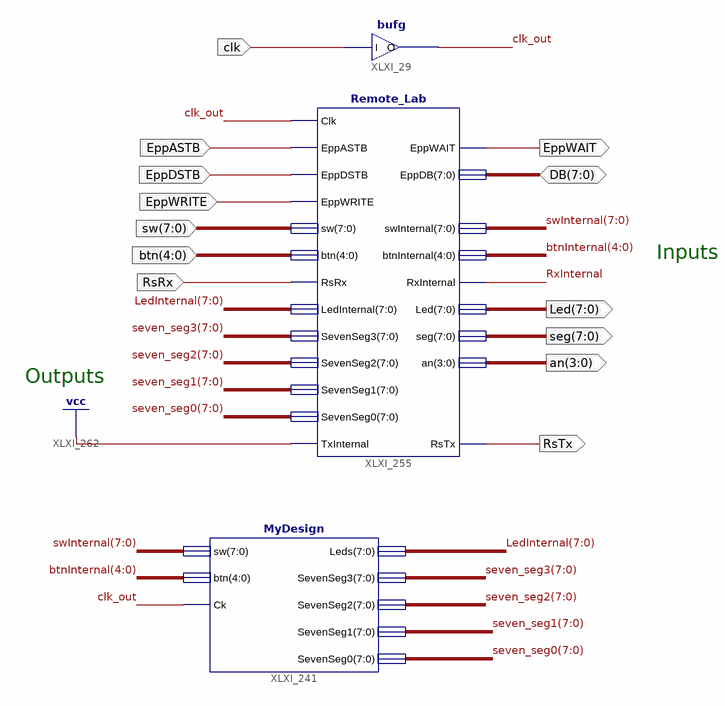
[diagram p0: schematic sheet 1]
// Xilinx ISE schematic top.sch (spartan6) as structural Verilog: 3 symbols, 13 ports
module top (
  input  EppASTB,
  input  EppDSTB,
  input  [7:0] sw,
  input  [4:0] btn,
  input  EppWRITE,
  input  RsRx,
  input  clk,
  inout  [7:0] DB,
  output EppWAIT,
  output [7:0] Led,
  output [7:0] seg,
  output [3:0] an,
  output RsTx
);

  wire clk_out, RxInternal;
  wire [4:0] btnInternal;
  wire [7:0] LedInternal, seven_seg0, seven_seg1, seven_seg2, seven_seg3, swInternal;

  MyDesign XLXI_241 (
    .btn(btnInternal), .Ck(clk_out), .Leds(LedInternal), .SevenSeg0(seven_seg0), .SevenSeg1(seven_seg1),
    .SevenSeg2(seven_seg2), .SevenSeg3(seven_seg3), .sw(swInternal));
  Remote_Lab XLXI_255 (
    .Clk(clk_out), .EppASTB(EppASTB), .EppDSTB(EppDSTB), .RsTx(RsTx), .EppWRITE(EppWRITE), .sw(sw),
    .btn(btn), .RsRx(RsRx), .LedInternal(LedInternal), .SevenSeg3(seven_seg3), .SevenSeg2(seven_seg2),
    .SevenSeg1(seven_seg1), .SevenSeg0(seven_seg0), .TxInternal(1'b1), .seg(seg), .an(an),
    .RxInternal(RxInternal), .swInternal(swInternal), .Led(Led), .EppWAIT(EppWAIT), .EppDB(DB),
    .btnInternal(btnInternal));
  bufg XLXI_29 (.I(clk), .O(clk_out));

  // Notes on the sheet:
  //   Inputs
  //   Outputs
endmodule
